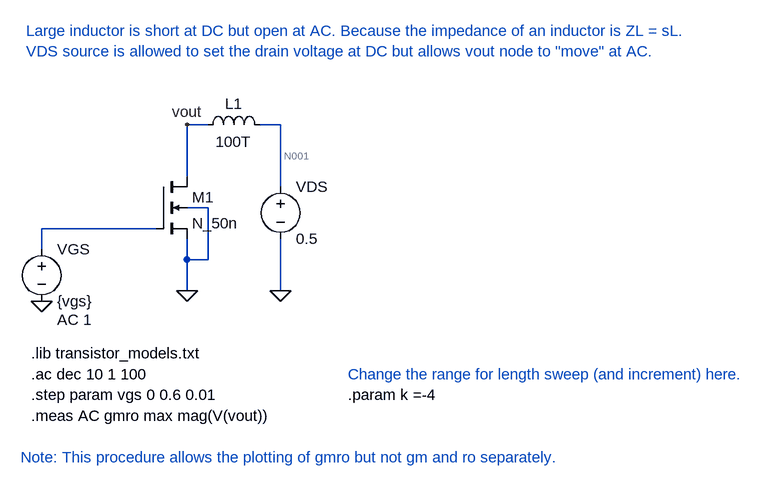
[diagram p0: schematic lab06_gmro_extract.asc]
lab06_gmro_extract.asc, the LTspice schematic file:
Version 4
SHEET 1 1100 680
WIRE -64 -64 -96 -64
WIRE 48 -64 16 -64
WIRE -96 16 -96 -64
WIRE 48 32 48 -64
WIRE -64 64 -96 64
WIRE -144 96 -320 96
WIRE -320 128 -320 96
WIRE -96 144 -96 112
WIRE -64 144 -64 64
WIRE -64 144 -96 144
WIRE -96 192 -96 144
WIRE 48 192 48 112
FLAG -96 192 0
FLAG 48 192 0
FLAG -320 208 0
FLAG -96 -64 vout
SYMBOL voltage 48 16 R0
WINDOW 123 0 0 Left 0
WINDOW 39 0 0 Left 0
SYMATTR InstName VDS
SYMATTR Value 0.5
SYMBOL voltage -320 112 R0
WINDOW 123 24 124 Left 2
WINDOW 39 0 0 Left 0
SYMATTR Value2 AC 1
SYMATTR InstName VGS
SYMATTR Value {vgs}
SYMBOL nmos4 -144 16 R0
SYMATTR InstName M1
SYMATTR Value N_50n
SYMATTR Value2 l={500n+100n*k} w=12u
SYMBOL ind -80 -48 R270
WINDOW 0 32 56 VTop 2
WINDOW 3 5 56 VBottom 2
SYMATTR InstName L1
SYMATTR Value 100T
TEXT -336 288 Left 2 !.lib transistor_models.txt
TEXT -336 320 Left 2 !.ac dec 10 1 100
TEXT -336 384 Left 2 !.meas AC gmro max mag(V(vout))
TEXT -344 -208 Left 2 ;Large inductor is short at DC but open at AC. Because the impedance of an inductor is ZL = sL.\nVDS source is allowed to set the drain voltage at DC but allows vout node to "move" at AC.
TEXT -352 448 Left 2 ;Note: This procedure allows the plotting of gmro but not gm and ro separately.
TEXT -336 352 Left 2 !.step param vgs 0 0.6 0.01
TEXT 152 352 Left 2 !.param k =-4
TEXT 152 320 Left 2 ;Change the range for length sweep (and increment) here.

The netlist it stands for:
* lab06_gmro_extract.asc
VDS N001 0 0.5
VGS N002 0 {vgs} AC 1
M1 vout N002 0 0 N_50n l={500n+100n*k} w=12u
L1 vout N001 100T
.model NMOS NMOS
.model PMOS PMOS
.lib standard.mos
.lib transistor_models.txt
.ac dec 10 1 100
.meas AC gmro max mag(V(vout))
* Large inductor is short at DC but open at AC. Because the impedance of an inductor is ZL = sL.
* VDS source is allowed to set the drain voltage at DC but allows vout node to "move" at AC.
* Note: This procedure allows the plotting of gmro but not gm and ro separately.
.step param vgs 0 0.6 0.01
.param k =-4
* Change the range for length sweep (and increment) here.
.backanno
.end

* Results of the author's LTspice run, read from the files saved beside the schematic
* Operating Point (first step), zero values left out:
*   V(n001) = 500 mV
*   V(vout) = 500 mV
*   Id(M1) = 8.078 nA
*   Ig(M1) = -928.4 pA
*   Is(M1) = -7.149 nA
*   I(L1) = -8.078 nA
*   I(Vgs) = 928.4 pA
*   I(Vds) = -8.078 nA
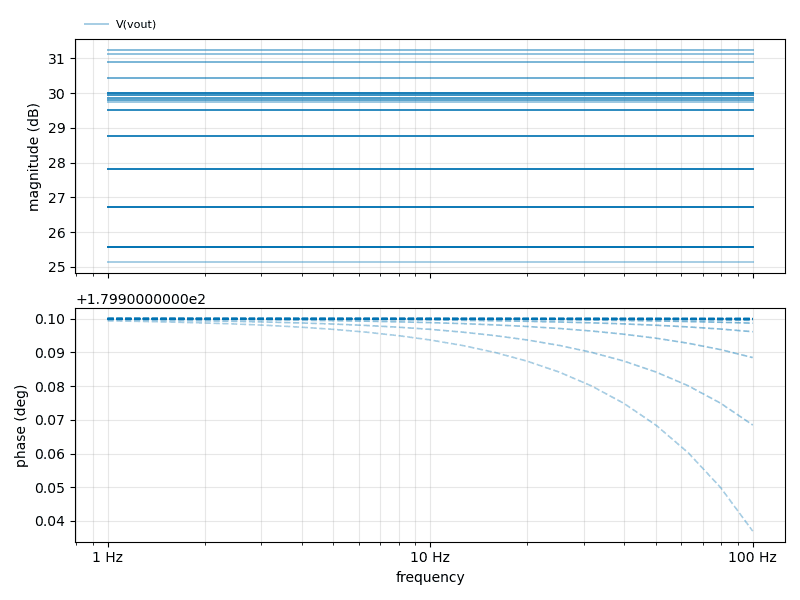
[diagram p1: AC Analysis of lab06_gmro_extract.asc, plotted from the saved traces]
* AC Analysis, 61 runs:
*   V(vout) [run 1]: 25.13 dB at 1 Hz, 25.13 dB at 100 Hz, peak 25.13 dB at 1 Hz
*   V(vout) [run 2]: 29.75 dB at 1 Hz, 29.75 dB at 100 Hz, peak 29.75 dB at 1 Hz
*   V(vout) [run 3]: 31.13 dB at 1 Hz, 31.13 dB at 100 Hz, peak 31.13 dB at 1 Hz
*   V(vout) [run 4]: 31.24 dB at 1 Hz, 31.24 dB at 100 Hz, peak 31.24 dB at 1 Hz
*   V(vout) [run 5]: 30.91 dB at 1 Hz, 30.91 dB at 100 Hz, peak 30.91 dB at 1 Hz
*   V(vout) [run 6]: 30.43 dB at 1 Hz, 30.43 dB at 100 Hz, peak 30.43 dB at 1 Hz
*   V(vout) [run 7]: 30.00 dB at 1 Hz, 30.00 dB at 100 Hz, peak 30.00 dB at 1 Hz
*   V(vout) [run 8]: 29.80 dB at 1 Hz, 29.80 dB at 100 Hz, peak 29.80 dB at 1 Hz
* From the log:
*   Measurement: gmro
*     step  MAX(mag(v(vout)))  FROM  TO
*        1  (25.1253dB,0°)  1  100
*        2  (26.7101dB,0°)  1  100
*        3  (27.9893dB,0°)  1  100
*        4  (28.9893dB,0°)  1  100
*        5  (29.7465dB,0°)  1  100
*        6  (30.3018dB,0°)  1  100
*        7  (30.6952dB,0°)  1  100
*        8  (30.9625dB,0°)  1  100
*        9  (31.1335dB,0°)  1  100
*       10  (31.2314dB,0°)  1  100
*       11  (31.2739dB,0°)  1  100
*       12  (31.2744dB,0°)  1  100
*       13  (31.2424dB,0°)  1  100
*       14  (31.1851dB,0°)  1  100
*       15  (31.1077dB,0°)  1  100
*       16  (31.0146dB,0°)  1  100
*       17  (30.909dB,0°)  1  100
*       18  (30.7942dB,0°)  1  100
*       19  (30.6733dB,0°)  1  100
*       20  (30.5492dB,0°)  1  100
*       21  (30.4251dB,0°)  1  100
*       22  (30.3045dB,0°)  1  100
*       23  (30.1905dB,0°)  1  100
*       24  (30.0865dB,0°)  1  100
*       25  (29.9955dB,0°)  1  100
*       26  (29.92dB,0°)  1  100
*       27  (29.862dB,0°)  1  100
*       28  (29.8226dB,0°)  1  100
*       29  (29.802dB,0°)  1  100
*       30  (29.7994dB,0°)  1  100
*       31  (29.8128dB,0°)  1  100
*       32  (29.8396dB,0°)  1  100
*       33  (29.8758dB,0°)  1  100
*       34  (29.9173dB,0°)  1  100
*       35  (29.9593dB,0°)  1  100
*       36  (29.9931dB,0°)  1  100
*       37  (30.0159dB,0°)  1  100
*       38  (30.0257dB,0°)  1  100
*       39  (30.0189dB,0°)  1  100
*       40  (29.9927dB,0°)  1  100
*     ...